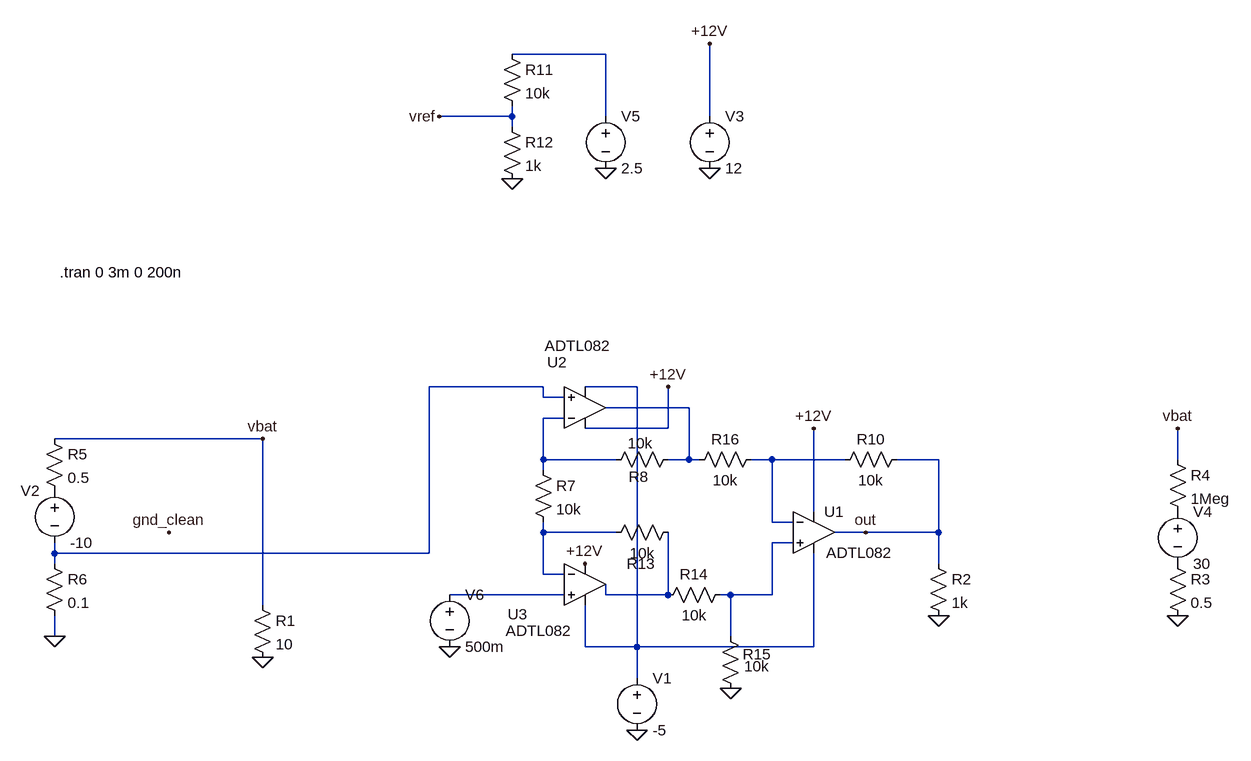
[diagram p0: schematic gnd_diff.asc]
gnd_diff.asc, the LTspice schematic file:
Version 4
SHEET 1 904 680
WIRE -64 -576 -208 -576
WIRE -208 -480 -208 -496
WIRE -208 -480 -320 -480
WIRE -64 -480 -64 -576
WIRE 96 -480 96 -592
WIRE -208 -464 -208 -480
WIRE -160 -64 -336 -64
WIRE -16 -64 -96 -64
WIRE -160 -48 -160 -64
WIRE -128 -48 -160 -48
WIRE 64 -32 -64 -32
WIRE -128 -16 -160 -16
WIRE 32 0 32 -64
WIRE 32 0 -96 0
WIRE -592 16 -912 16
WIRE -160 48 -160 -16
WIRE -48 48 -160 48
WIRE 64 48 64 -32
WIRE 64 48 32 48
WIRE 80 48 64 48
WIRE 192 48 160 48
WIRE 304 48 192 48
WIRE 448 48 384 48
WIRE 816 48 816 0
WIRE -160 64 -160 48
WIRE 256 128 256 0
WIRE 192 144 192 48
WIRE 224 144 192 144
WIRE -160 160 -160 144
WIRE -48 160 -160 160
WIRE 336 160 288 160
WIRE 448 160 448 48
WIRE 448 160 336 160
WIRE 224 176 192 176
WIRE -912 192 -912 176
WIRE -336 192 -336 -64
WIRE -336 192 -912 192
WIRE -912 208 -912 192
WIRE 448 208 448 160
WIRE -160 224 -160 160
WIRE -128 224 -160 224
WIRE -128 256 -304 256
WIRE -64 256 -64 240
WIRE 32 256 32 160
WIRE 32 256 -64 256
WIRE 128 256 112 256
WIRE 192 256 192 176
WIRE 192 256 128 256
WIRE -592 272 -592 16
WIRE -912 320 -912 288
WIRE 128 320 128 256
WIRE -96 336 -96 272
WIRE -16 336 -16 -64
WIRE -16 336 -96 336
WIRE 256 336 256 192
WIRE 256 336 -16 336
WIRE -16 384 -16 336
FLAG -912 320 0
FLAG 448 288 0
FLAG 96 -400 0
FLAG 336 160 out
FLAG -736 160 gnd_clean
FLAG -64 -400 0
FLAG -320 -480 vref
FLAG 816 288 0
FLAG 96 -592 +12V
FLAG 256 0 +12V
FLAG -592 352 0
FLAG -592 16 vbat
FLAG 816 0 vbat
FLAG -208 -384 0
FLAG -96 208 +12V
FLAG 32 -64 +12V
FLAG 128 400 0
FLAG -16 464 0
FLAG -304 336 0
SYMBOL OpAmps\\ADTL082 256 96 R0
WINDOW 3 19 95 Left 2
SYMATTR InstName U1
SYMBOL voltage -912 80 R0
WINDOW 123 0 0 Left 0
WINDOW 39 0 0 Left 0
WINDOW 0 -52 16 Left 2
SYMATTR InstName V2
SYMATTR Value -10
SYMBOL res -928 192 R0
SYMATTR InstName R6
SYMATTR Value 0.1
SYMBOL res -608 256 R0
SYMATTR InstName R1
SYMATTR Value 10
SYMBOL res 432 192 R0
SYMATTR InstName R2
SYMATTR Value 1k
SYMBOL voltage 96 -496 R0
WINDOW 123 0 0 Left 0
WINDOW 39 0 0 Left 0
SYMATTR InstName V3
SYMATTR Value 12
SYMBOL voltage 816 112 R0
WINDOW 123 0 0 Left 0
WINDOW 39 0 0 Left 0
SYMATTR InstName V4
SYMATTR Value 30
SYMBOL voltage -64 -496 R0
WINDOW 123 0 0 Left 0
WINDOW 39 0 0 Left 0
SYMATTR InstName V5
SYMATTR Value 2.5
SYMBOL res 800 192 R0
SYMATTR InstName R3
SYMATTR Value 0.5
SYMBOL res 800 32 R0
SYMATTR InstName R4
SYMATTR Value 1Meg
SYMBOL res -928 0 R0
SYMATTR InstName R5
SYMATTR Value 0.5
SYMBOL res 400 32 R90
WINDOW 0 0 56 VBottom 2
WINDOW 3 32 56 VTop 2
SYMATTR InstName R10
SYMATTR Value 10k
SYMBOL res -224 -592 R0
SYMATTR InstName R11
SYMATTR Value 10k
SYMBOL res -224 -480 R0
SYMATTR InstName R12
SYMATTR Value 1k
SYMBOL OpAmps\\ADTL082 -96 32 M180
WINDOW 3 -62 159 Left 2
WINDOW 0 -58 134 Left 2
SYMATTR InstName U2
SYMBOL OpAmps\\ADTL082 -96 176 R0
WINDOW 3 -122 135 Left 2
WINDOW 0 -119 110 Left 2
SYMATTR InstName U3
SYMBOL res -176 48 R0
SYMATTR InstName R7
SYMATTR Value 10k
SYMBOL res 48 32 R90
WINDOW 0 58 61 VBottom 2
WINDOW 3 -25 59 VTop 2
SYMATTR InstName R8
SYMATTR Value 10k
SYMBOL res 48 144 R90
WINDOW 0 80 58 VBottom 2
WINDOW 3 32 56 VTop 2
SYMATTR InstName R13
SYMATTR Value 10k
SYMBOL res 128 240 R90
WINDOW 0 0 56 VBottom 2
WINDOW 3 32 56 VTop 2
SYMATTR InstName R14
SYMATTR Value 10k
SYMBOL res 144 416 R180
WINDOW 0 -47 69 Left 2
WINDOW 3 -44 50 Left 2
SYMATTR InstName R15
SYMATTR Value 10k
SYMBOL res 176 32 R90
WINDOW 0 0 56 VBottom 2
WINDOW 3 32 56 VTop 2
SYMATTR InstName R16
SYMATTR Value 10k
SYMBOL voltage -16 368 R0
WINDOW 123 0 0 Left 0
WINDOW 39 0 0 Left 0
SYMATTR InstName V1
SYMATTR Value -5
SYMBOL voltage -304 240 R0
WINDOW 123 0 0 Left 0
WINDOW 39 0 0 Left 0
SYMATTR InstName V6
SYMATTR Value 500m
TEXT -904 -240 Left 2 !.tran 0 3m 0 200n

The netlist it stands for:
* gnd_diff.asc
XU1 N008 N006 +12V N003 out ADTL082  ; pins In+ In- V+ V- OUT
V2 P001 N002 -10
R6 N002 0 0.1
R1 vbat 0 10
R2 out 0 1k
V3 +12V 0 12
V4 P002 P003 30
V5 N001 0 2.5
R3 P003 0 0.5
R4 vbat P002 1Meg
R5 vbat P001 0.5
R10 out N006 10k
R11 N001 vref 10k
R12 vref 0 1k
XU2 N002 N005 +12V N003 N004 ADTL082  ; pins In+ In- V+ V- OUT
XU3 N009 N007 +12V N003 N010 ADTL082  ; pins In+ In- V+ V- OUT
R7 N005 N007 10k
R8 N004 N005 10k
R13 N010 N007 10k
R14 N008 N010 10k
R15 0 N008 10k
R16 N006 N004 10k
V1 N003 0 -5
V6 N009 0 500m
.tran 0 3m 0 200n
.lib ADI.lib
.backanno
.end